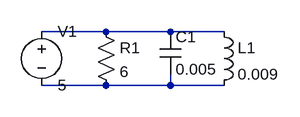
[diagram p0: schematic rclpar.asc]
rclpar.asc, the LTspice schematic file:
Version 4
SHEET 1 880 680
WIRE 192 128 96 128
WIRE 288 128 192 128
WIRE 368 128 288 128
WIRE 192 208 96 208
WIRE 288 208 288 192
WIRE 288 208 192 208
WIRE 368 208 288 208
SYMBOL voltage 96 112 R0
WINDOW 123 0 0 Left 0
WINDOW 39 0 0 Left 0
SYMATTR InstName V1
SYMATTR Value 5
SYMBOL res 176 112 R0
SYMATTR InstName R1
SYMATTR Value 6
SYMBOL cap 272 128 R0
SYMATTR InstName C1
SYMATTR Value 0.005
SYMBOL ind 352 112 R0
SYMATTR InstName L1
SYMATTR Value 0.009

The netlist it stands for:
* rclpar.asc
V1 N001 N002 5
R1 N001 N002 6
C1 N001 N002 0.005
L1 N001 N002 0.009
.backanno
.end